# EAGLE design wbo2_1A (EAGLE 7.6.0)
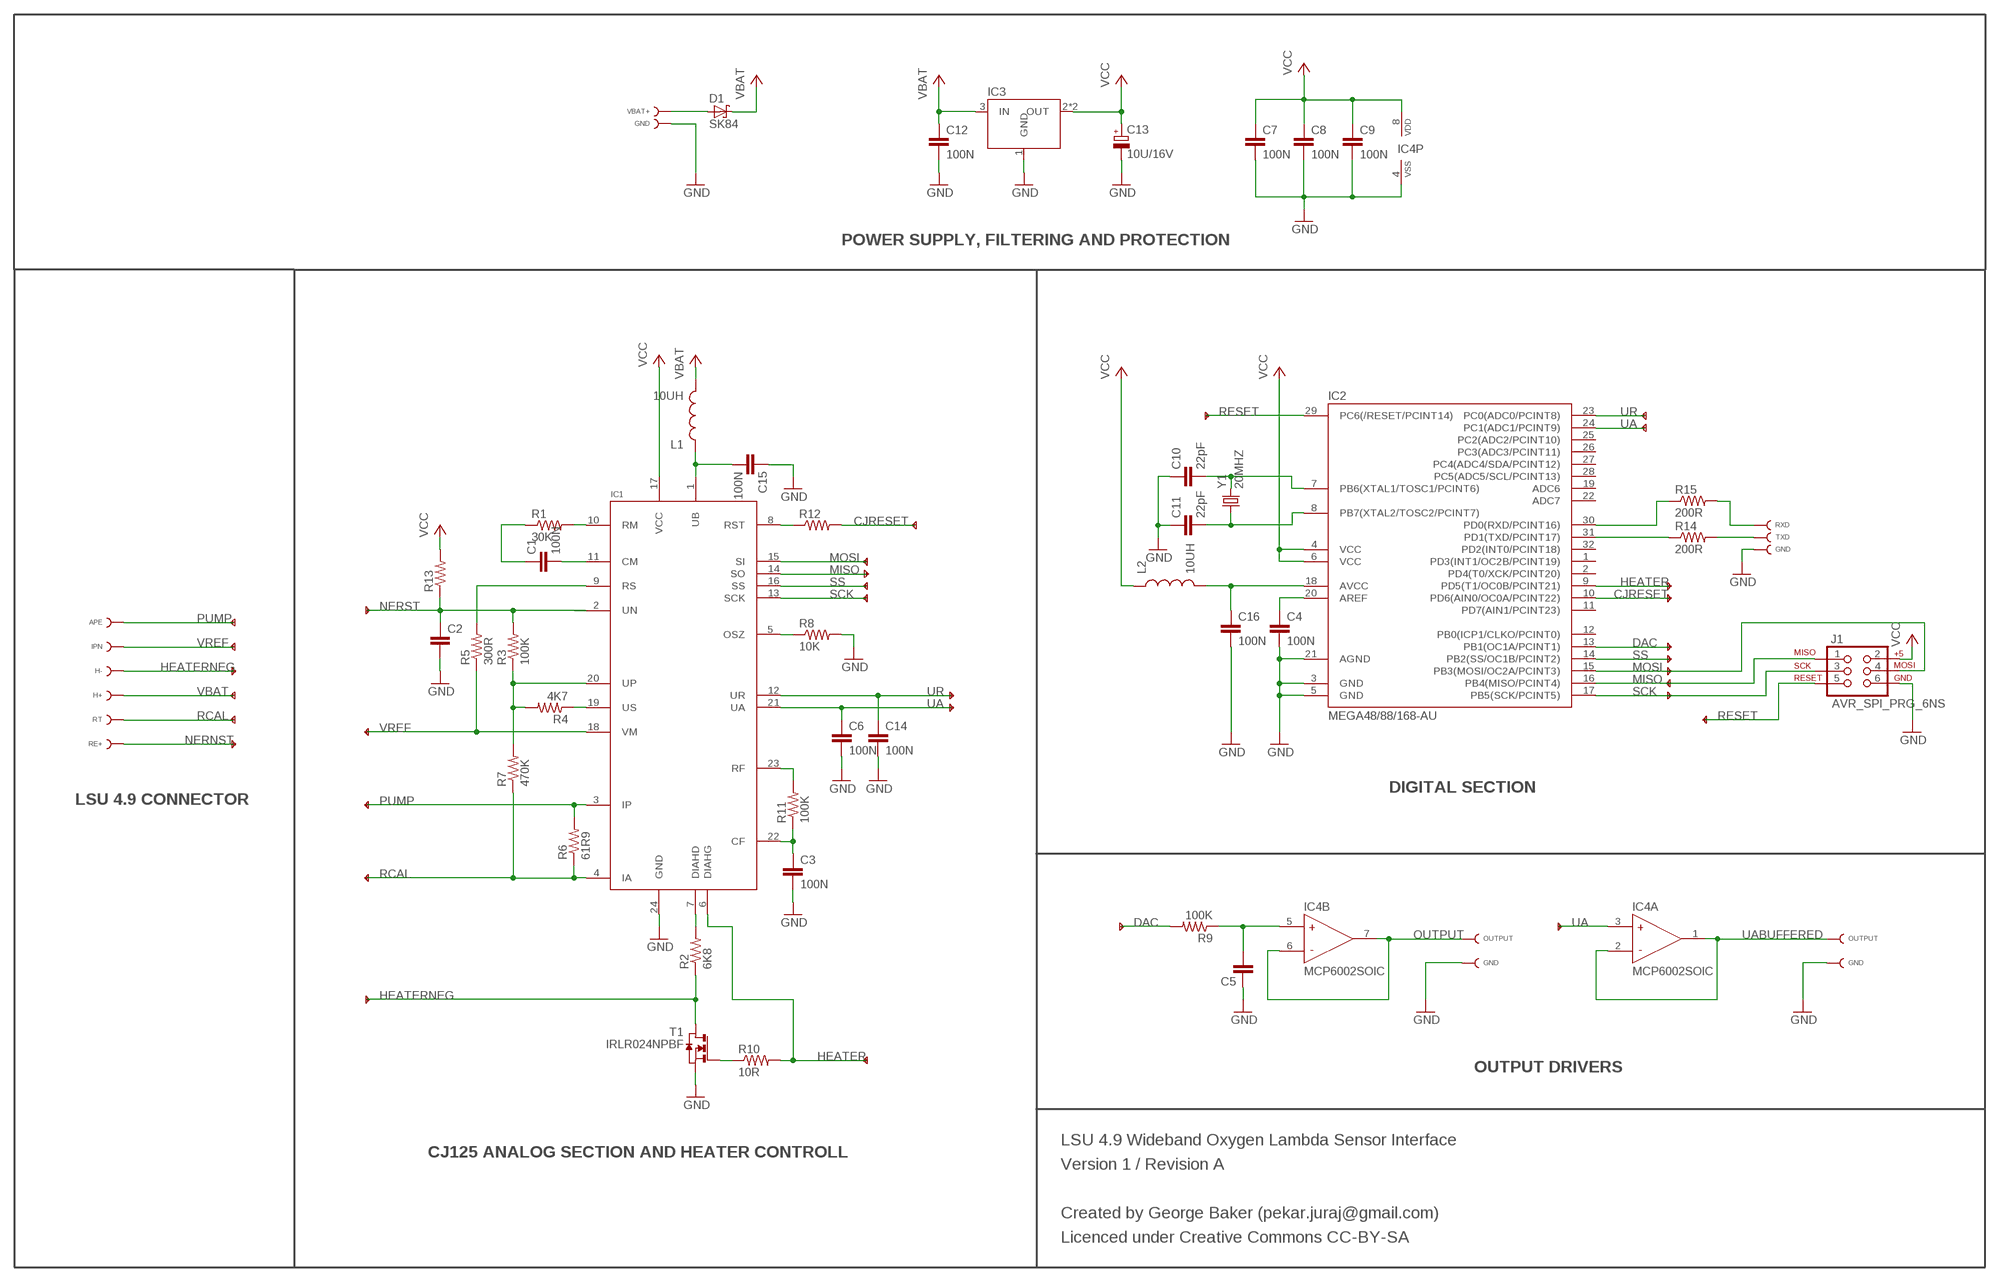
[diagram p0: schematic, sheet 1]

## Parts
C1  100N  CAP0805  [0805]
C2  CAP0805  [0805]
C3  100N  CAP0805  [0805]
C4  100N  CAP0805  [0805]
C5  CAP0805  [0805]
C6  100N  CAP0805  [0805]
C7  100N  CAP0805  [0805]
C8  100N  CAP0805  [0805]
C9  100N  CAP0805  [0805]
C10  22pF  CAP0805  [0805]
C11  22pF  CAP0805  [0805]
C12  100N  CAP0805  [0805]
C13  10U/16V  CPOL-EUSMCA  [SMC_A]
C14  100N  CAP0805  [0805]
C15  100N  CAP0805  [0805]
C16  100N  CAP0805  [0805]
D1  SK84  SCHOTTKY-DIODESMC  [SMC]
IC1  CJ125_SOIC24  [SO24W]
IC2  MEGA48/88/168-AU  [TQFP32-08]
IC3  REG1117_SOT-223  [SOT223]
IC4  MCP6002SOIC  [SO8]
J1  AVR_SPI_PRG_6NS  [2X3-NS]
L1  10UH  INDUCTOR0805  [0805]
L2  10UH  INDUCTOR0805  [0805]
PAD1  APE  CONPAD-DUAL-HOLE-1.5MM  [CONPAD-DUAL-HOLE-1.5MM]
PAD2  IPN  CONPAD-DUAL-HOLE-1.5MM  [CONPAD-DUAL-HOLE-1.5MM]
PAD3  H-  CONPAD-DUAL-HOLE-1.5MM  [CONPAD-DUAL-HOLE-1.5MM]
PAD4  H+  CONPAD-DUAL-HOLE-1.5MM  [CONPAD-DUAL-HOLE-1.5MM]
PAD5  RT  CONPAD-DUAL-HOLE-1.5MM  [CONPAD-DUAL-HOLE-1.5MM]
PAD6  RE+  CONPAD-DUAL-HOLE-1.5MM  [CONPAD-DUAL-HOLE-1.5MM]
PAD7  VBAT+  CONPAD-DUAL-HOLE-1.5MM  [CONPAD-DUAL-HOLE-1.5MM]
PAD8  GND  CONPAD-DUAL-HOLE-1.5MM  [CONPAD-DUAL-HOLE-1.5MM]
PAD9  RXD  CONPAD-DUAL-HOLE-1.5MM  [CONPAD-DUAL-HOLE-1.5MM]
PAD10  TXD  CONPAD-DUAL-HOLE-1.5MM  [CONPAD-DUAL-HOLE-1.5MM]
PAD11  GND  CONPAD-DUAL-HOLE-1.5MM  [CONPAD-DUAL-HOLE-1.5MM]
PAD12  OUTPUT  CONPAD-DUAL-HOLE-1.5MM  [CONPAD-DUAL-HOLE-1.5MM]
PAD13  GND  CONPAD-DUAL-HOLE-1.5MM  [CONPAD-DUAL-HOLE-1.5MM]
PAD14  OUTPUT  CONPAD-DUAL-HOLE-1.5MM  [CONPAD-DUAL-HOLE-1.5MM]
PAD15  GND  CONPAD-DUAL-HOLE-1.5MM  [CONPAD-DUAL-HOLE-1.5MM]
R1  30K  RESISTOR0805-RES  [0805]
R2  6K8  RESISTOR0805-RES  [0805]
R3  100K  RESISTOR0805-RES  [0805]
R4  4K7  RESISTOR0805-RES  [0805]
R5  300R  RESISTOR0805-RES  [0805]
R6  61R9  RESISTOR0805-RES  [0805]
R7  470K  RESISTOR0805-RES  [0805]
R8  10K  RESISTOR0805-RES  [0805]
R9  100K  RESISTOR0805-RES  [0805]
R10  10R  RESISTOR0805-RES  [0805]
R11  100K  RESISTOR0805-RES  [0805]
R12  RESISTOR0805-RES  [0805]
R13  RESISTOR0805-RES  [0805]
R14  200R  RESISTOR0805-RES  [0805]
R15  200R  RESISTOR0805-RES  [0805]
T1  IRLR024NPBF  NMOSFET_TO252  [TO252]
Y1  20MHZ  CRYSTAL_ILCX13  [CRYSTAL_ILCX13]

## Nets
CJRESET: IC2.10(PD6(AIN0/OC0A/PCINT22)) R12.2
DAC: IC2.13(PB1(OC1A/PCINT1)) R9.2
GND: C2.2 C3.2 C4.2 C5.1 C6.2 C7.2 C8.2 C9.2 C10.1 C11.1 C12.2 C13.- C14.2 C15.1 C16.2 IC1.24(GND) IC2.3(GND) IC2.5(GND) IC2.21(AGND) IC3.1(GND) IC4.4(P:VSS) J1.6 PAD8.P$1@1 PAD8.P$1@2 PAD11.P$1@1 PAD11.P$1@2 PAD13.P$1@1 PAD13.P$1@2 PAD15.P$1@1 PAD15.P$1@2 R8.2 T1.2(S)
HEATER: IC1.6(DIAHG) IC2.9(PD5(T1/OC0B/PCINT21)) R10.2
HEATERNEG: PAD3.P$1@1 PAD3.P$1@2 R2.1 T1.3(D)
MISO: IC1.14(SO) IC2.16(PB4(MISO/PCINT4)) J1.1
MOSI: IC1.15(SI) IC2.15(PB3(MOSI/OC2A/PCINT3)) J1.4
N$1: IC1.7(DIAHD) R2.2
N$2: IC1.23(RF) R11.2
N$3: C3.1 IC1.22(CF) R11.1
N$4: C16.1 IC2.18(AVCC) L2.2
N$5: C15.2 IC1.1(UB) L1.1
N$6: IC1.19(US) R4.1
N$7: C4.1 IC2.20(AREF)
N$8: IC1.20(UP) R3.1 R4.2 R7.2
N$9: C10.2 IC2.7(PB6(XTAL1/TOSC1/PCINT6)) Y1.3
N$10: C5.2 IC4.5(B:NONINV) R9.1
N$11: C11.2 IC2.8(PB7(XTAL2/TOSC2/PCINT7)) Y1.1
N$12: D1.A PAD7.P$1@1 PAD7.P$1@2
N$13: IC1.10(RM) R1.2
N$14: R10.1 T1.1(G)
N$15: PAD10.P$1@1 PAD10.P$1@2 R14.2
N$16: IC1.9(RS) R5.2
N$17: PAD9.P$1@1 PAD9.P$1@2 R15.2
N$18: C1.1 R1.1
N$19: C1.2 IC1.11(CM)
N$22: IC1.5(OSZ) R8.1
N$24: IC1.8(RST) R12.1
NERNST: PAD6.P$1@1 PAD6.P$1@2
NERST: C2.1 IC1.2(UN) R3.2 R13.1
OUTPUT: IC4.6(B:INV) IC4.7(B:OUT) PAD12.P$1@1 PAD12.P$1@2
PUMP: IC1.3(IP) PAD1.P$1@1 PAD1.P$1@2 R6.2
RCAL: IC1.4(IA) PAD5.P$1@1 PAD5.P$1@2 R6.1 R7.1
RESET: IC2.29(PC6(/RESET/PCINT14)) J1.5
RXD: IC2.30(PD0(RXD/PCINT16)) R15.1
SCK: IC1.13(SCK) IC2.17(PB5(SCK/PCINT5)) J1.3
SS: IC1.16(SS) IC2.14(PB2(SS/OC1B/PCINT2))
TXD: IC2.31(PD1(TXD/PCINT17)) R14.1
UA: C6.1 IC1.21(UA) IC2.24(PC1(ADC1/PCINT9)) IC4.3(A:NONINV)
UABUFFERED: IC4.1(A:OUT) IC4.2(A:INV) PAD14.P$1@1 PAD14.P$1@2
UR: C14.1 IC1.12(UR) IC2.23(PC0(ADC0/PCINT8))
VBAT: C12.1 D1.C IC3.3(IN) L1.2 PAD4.P$1@1 PAD4.P$1@2
VCC: C7.1 C8.1 C9.1 C13.+ IC1.17(VCC) IC2.4(VCC) IC2.6(VCC) IC3.2(OUT) IC3.4(OUT) IC4.8(P:VDD) J1.2 L2.1 R13.2
VREF: IC1.18(VM) PAD2.P$1@1 PAD2.P$1@2 R5.1
Unconnected: IC2.1(PD3(INT1/OC2B/PCINT19)) IC2.2(PD4(T0/XCK/PCINT20)) IC2.11(PD7(AIN1/PCINT23)) IC2.12(PB0(ICP1/CLKO/PCINT0)) IC2.19(ADC6) IC2.22(ADC7) IC2.25(PC2(ADC2/PCINT10)) IC2.26(PC3(ADC3/PCINT11)) IC2.27(PC4(ADC4/SDA/PCINT12)) IC2.28(PC5(ADC5/SCL/PCINT13)) IC2.32(PD2(INT0/PCINT18))

## Notes on the sheet
- POWER SUPPLY, FILTERING AND PROTECTION
- DIGITAL SECTION
- LSU 4.9 CONNECTOR
- OUTPUT DRIVERS
- LSU 4.9 Wideband Oxygen Lambda Sensor Interface
- CJ125 ANALOG SECTION AND HEATER CONTROLL
- Version 1 / Revision A
- Created by George Baker (pekar.juraj@gmail.com)
- Licenced under Creative Commons CC-BY-SA

## Library data of the parts
C1-C12 C14-C16 = SparkFun-Capacitors:CAP: Capacitor Standard 0603 ceramic capacitor, and 0.1" leaded capacitor.
C13 = rcl:CPOL-EU: POLARIZED CAPACITOR, European symbol
D1 = diode:SCHOTTKY-DIODE: Schottky Diode
IC1 = GGLibrary:CJ125
IC2 = avr-6:MEGA48/88/168
IC3 = GGLibrary:REG1117
IC4 = GGLibrary:MCP6002
J1 = SparkFun-Connectors:AVR_SPI_PRG_6: AVR ISP 6 Pin This is the reduced ISP connector for AVR programming. Common on Arduino. This footprint will take up less PCB space and can be used with a 10-pin to 6-pin adapter such as SKU: BOB-08508
L1 L2 = SparkFun-Passives:INDUCTOR: Inductors Basic Inductor/Choke - 0603 and 1206. Footprints are not proven and vary greatly between part numbers. SRN6045- 33uH, 20% 1.4A
PAD1-PAD15 = GGLibrary:CONPAD
R1-R15 = SparkFun-Resistors:RESISTOR: Resistor Basic schematic elements and footprints for 0603, 1206, and PTH resistors.
T1 = GGLibrary:NMOSFET
Y1 = GGLibrary:CRYSTAL: Various standard crystals. Proven footprints. Spark Fun Electronics SKU : COM-00534

## Board
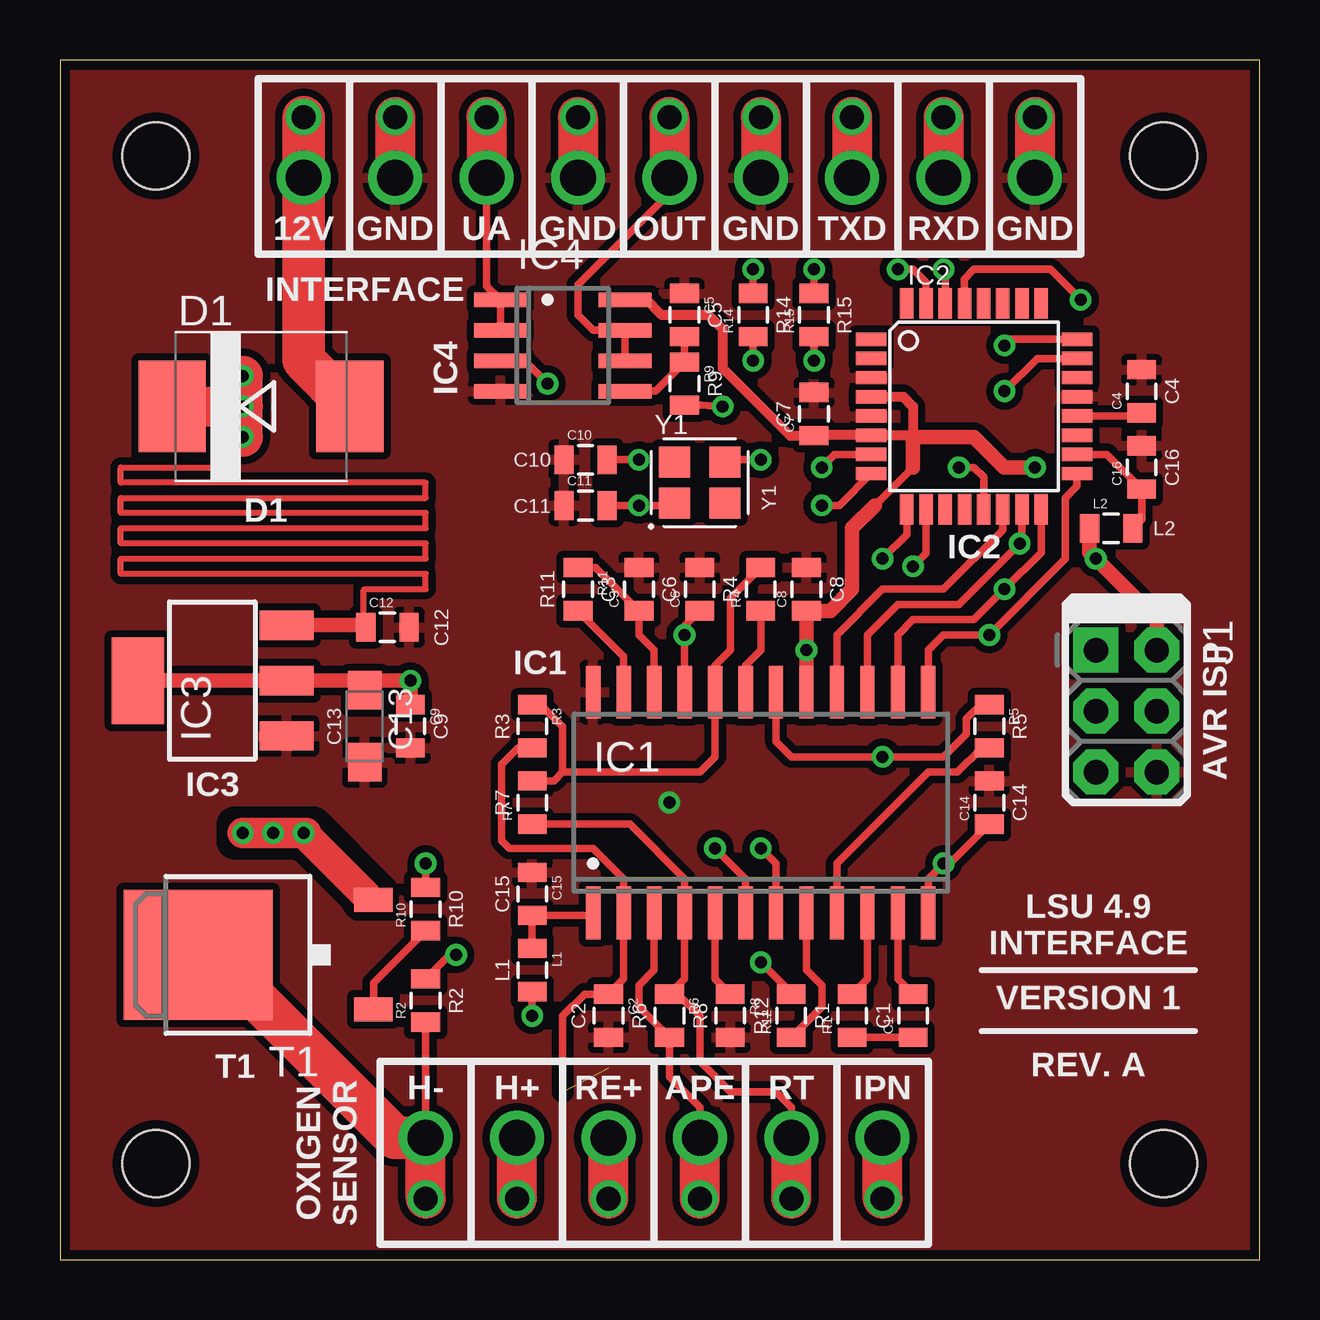
[diagram p1: board, top side]
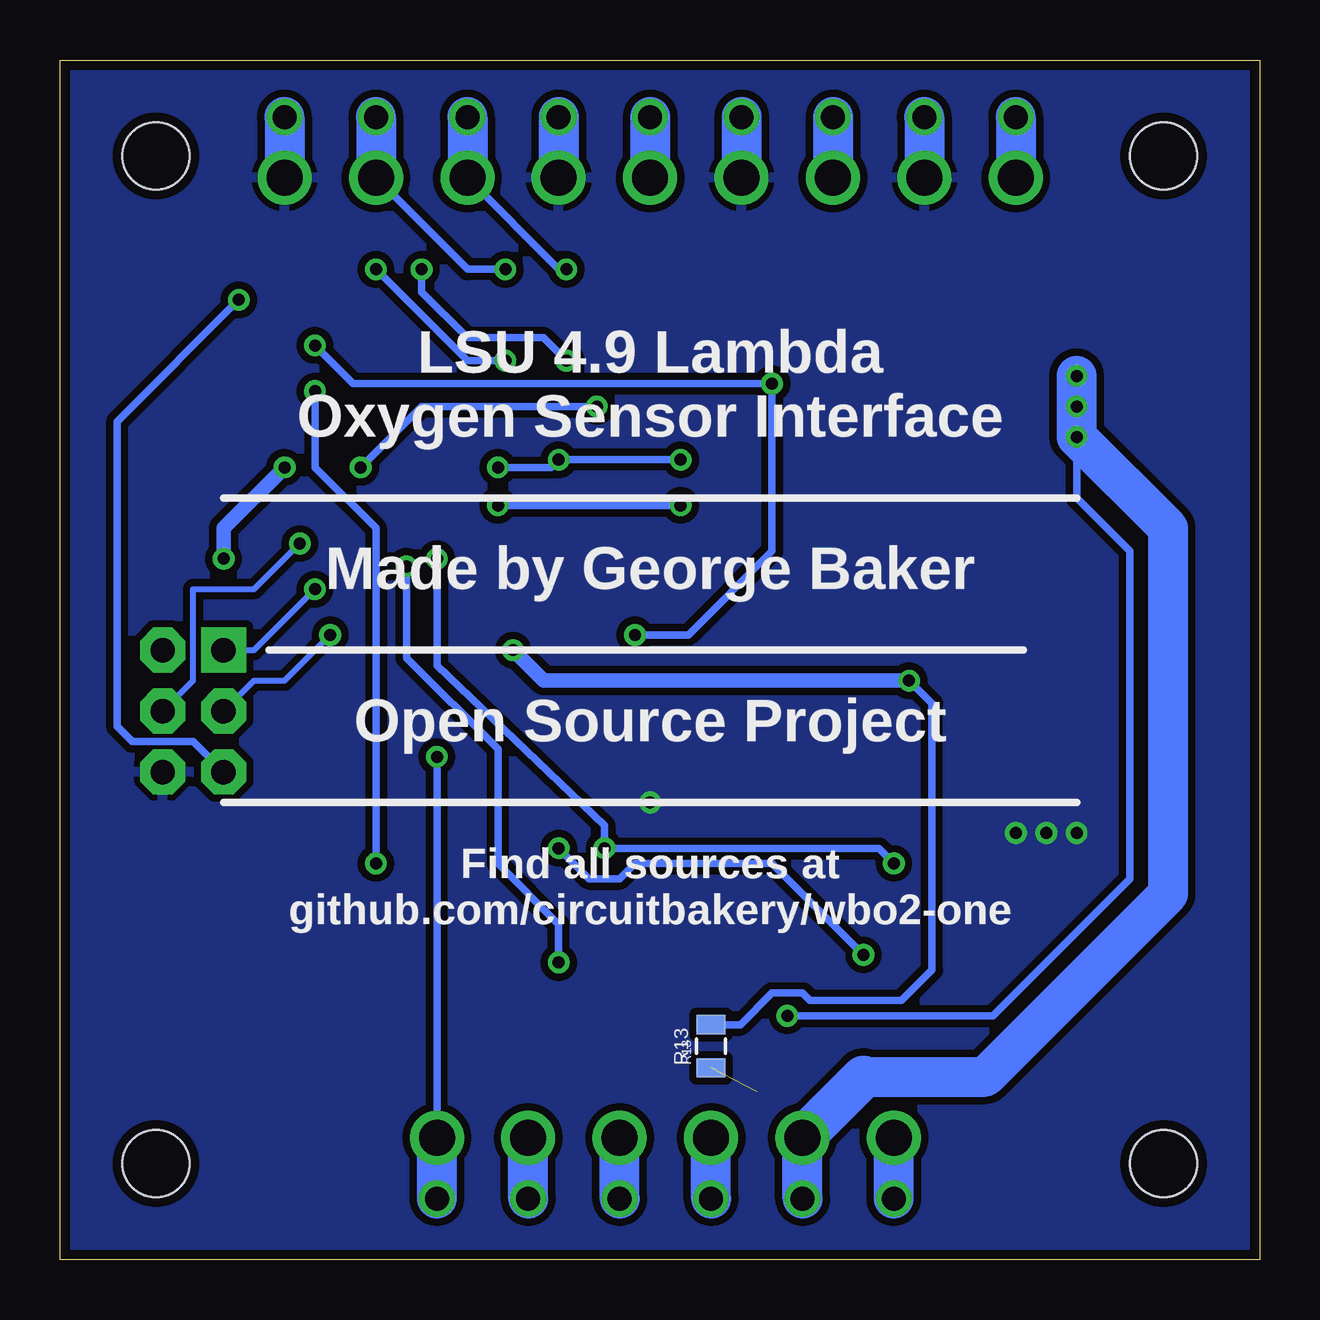
[diagram p2: board, bottom side, seen from below]

Size 50 x 50 mm. Coordinates in mm from the lower left corner, seen from the top.
Outline: 0,0 50,0 50,50 0,50 0,0
Copper layers (1*16): Top 0.035mm / dielectric 1.5mm / Bottom 0.035mm
Design rules "default *": minimum track width 6mil, minimum drill 12mil, track to track 6mil, track to pad 6mil, pad to pad 6mil, via to via 6mil, smd to smd 6mil, copper to edge 16mil, drill to drill 8mil, minimum pad ring 10mil, minimum via ring 8mil, stop-mask expansion 3mil, vias tented up to drill 20mil, thermal gap 10mil
Holes 2.8 mm at 4,46 46,46 4,4 46,4

### Footprints (pad centres in the part's own frame; a part is rotated, then mirrored left to right if it is on the bottom)
0805 = smd 0.8 x 1.2: 1 -0.9,0; 2 0.9,0
SMC_A = smd 1.6 x 1.4: + -1.5,0; - 1.5,0
SMC = smd 2.8 x 3.8: A 3.7,0; C -3.7,0
SO24W = smd 0.6 x 2.2: 1 -6.985,-4.6; 2 -5.715,-4.6; 3 -4.445,-4.6; 4 -3.175,-4.6; 5 -1.905,-4.6; 6 -0.635,-4.6; 7 0.635,-4.6; 8 1.905,-4.6; 9 3.175,-4.6; 10 4.445,-4.6; 11 5.715,-4.6; 12 6.985,-4.6; 13 6.985,4.6; 14 5.715,4.6; 15 4.445,4.6; 16 3.175,4.6; 17 1.905,4.6; 18 0.635,4.6; 19 -0.635,4.6; 20 -1.905,4.6; 21 -3.175,4.6; 22 -4.445,4.6; 23 -5.715,4.6; 24 -6.985,4.6
TQFP32-08 = smd 1.27 x 0.559: 1 -4.293,2.8; 2 -4.293,2; 3 -4.293,1.2; 4 -4.293,0.4; 5 -4.293,-0.4; 6 -4.293,-1.2; 7 -4.293,-2; 8 -4.293,-2.8; 17 4.293,-2.8; 18 4.293,-2; 19 4.293,-1.2; 20 4.293,-0.4; 21 4.293,0.4; 22 4.293,1.2; 23 4.293,2; 24 4.293,2.8 | smd 0.559 x 1.27: 9 -2.8,-4.293; 10 -2,-4.293; 11 -1.2,-4.293; 12 -0.4,-4.293; 13 0.4,-4.293; 14 1.2,-4.293; 15 2,-4.293; 16 2.8,-4.293; 25 2.8,4.293; 26 2,4.293; 27 1.2,4.293; 28 0.4,4.293; 29 -0.4,4.293; 30 -1.2,4.293; 31 -2,4.293; 32 -2.8,4.293
SOT223 = smd 1.219 x 2.235: 1 -2.311,-3.099; 2 0,-3.099; 3 2.311,-3.099 | smd 3.6 x 2.2: 4 0,3.099
SO8 = smd 0.6 x 2.2: 1 -1.905,-2.6; 2 -0.635,-2.6; 3 0.635,-2.6; 4 1.905,-2.6; 5 1.905,2.6; 6 0.635,2.6; 7 -0.635,2.6; 8 -1.905,2.6
2X3-NS = drill 1.016 pad 1.88 square: 1 -2.54,-1.27 | drill 1.016 pad 1.88 octagon: 2 -2.54,1.27; 3 0,-1.27; 4 0,1.27; 5 2.54,-1.27; 6 2.54,1.27
CONPAD-DUAL-HOLE-1.5MM = drill 1: P$1@1 0,0 | drill 1.5: P$1@2 0,-2.54
TO252 = smd 1 x 1.6: 1 -2.28,-4.8; 2 2.28,-4.8 | smd 5.4 x 6.2: 3 0,2.5
CRYSTAL_ILCX13 = smd 1.3 x 1.3: 1 -1.05,-0.85; 2 1.05,-0.85; 3 1.05,0.85; 4 -1.05,0.85

### Placement (x,y rotation side)
C1  35.56,10.16 90 top
C2  22.86,10.16 270 top
C3  24.13,27.94 90 top
C4  45.09,36.2 90 top
C5  26.04,39.37 270 top
C6  26.67,27.94 90 top
C7  31.43,35.24 90 top
C8  31.11,27.94 90 top
C9  14.61,22.23 270 top
C10  21.91,33.34 0 top
C11  21.91,31.43 0 top
C12  13.65,26.35 0 top
C13  12.7,22.23 270 top
C14  38.73,19.05 90 top
C15  19.68,15.24 270 top
C16  45.09,33.02 90 top
D1  8.38,35.56 0 top
IC1  29.21,19.05 0 top
IC2  38.1,35.56 0 top
IC3  6.35,24.13 90 top
IC4  20.95,38.1 270 top
J1  44.45,22.86 270 top
L1  19.68,12.06 270 top
L2  43.81,30.48 0 top
PAD1  26.67,2.54 180 top
PAD2  34.29,2.54 180 top
PAD3  15.24,2.54 180 top
PAD4  19.05,2.54 180 top
PAD5  30.48,2.54 180 top
PAD6  22.86,2.54 180 top
PAD7  10.16,47.62 0 top
PAD8  13.97,47.62 0 top
PAD9  36.83,47.62 0 top
PAD10  33.02,47.62 0 top
PAD11  40.64,47.62 0 top
PAD12  25.4,47.62 0 top
PAD13  29.21,47.62 0 top
PAD14  17.78,47.62 0 top
PAD15  21.59,47.62 0 top
R1  33.02,10.16 90 top
R2  15.24,10.79 90 top
R3  19.68,22.23 270 top
R4  29.21,27.94 90 top
R5  38.73,22.23 270 top
R6  25.4,10.16 270 top
R7  19.68,19.05 90 top
R8  27.94,10.16 270 top
R9  26.04,36.51 270 top
R10  15.24,14.61 90 top
R11  21.59,27.94 270 top
R12  30.48,10.16 90 top
R13  22.86,8.89 90 bottom
R14  28.89,39.37 90 top
R15  31.43,39.37 90 top
T1  8.26,12.7 90 top
Y1  26.67,32.38 0 top

### Tracks (layer width: path | path; a pad name or v marks a point on that pad's centre or on a via)
CJRESET  (via drill 0.5)
  Top 0.305: 30.48,11.11 v29.21,12.38 | v35.56,28.89 36.1,29.43 IC2.10
  Top 0.406: R12.2 30.48,11.11
  Bottom 0.305: v29.21,12.38 29.21,13.97 31.75,16.51 31.75,21.27 35.56,25.08 v35.56,28.89
DAC  (via drill 0.5)
  Top 0.305: IC2.13 38.5,32.62 38.1,33.02 v37.47,33.02 | R9.2 26.72,35.61 v27.62,35.56
  Bottom 0.305: v37.47,33.02 34.92,35.56 v27.62,35.56
GND  (via drill 0.5)
  Top 1.016: T1.2 arc-45 12.89,15.05 12.7,15.24
  Top 1.27: v7.62,17.78 v10.16,17.78 | v10.16,17.78 10.26,17.78 | 12.7,15.24 v10.16,17.78
  other vias: 25.4,19.05 8.89,17.78
  pour Top (isolate 0.305): -2.54,-3.81 52.07,-3.81 52.07,50.8 -2.54,50.8
  pour Bottom (isolate 0.305): -1.27,-2.54 53.34,-2.54 53.34,52.07 -1.27,52.07
  cutout Top (rank 2): 13.97,14.29 13.97,15.29 arc45 13.78,15.74 10.98,18.55 arc45 10.53,18.73 7.3,18.73 arc90 6.67,18.1 6.67,17.46 arc90 7.3,16.83 9.58,16.83 arc-45 10.03,16.64 11.88,14.79 arc45 12.33,14.29
HEATER  (via drill 0.5)
  Top 0.305: IC1.6 28.57,15.88 v27.3,17.14 | v15.24,16.51 R10.2 | IC2.9 35.3,30.22 v34.29,29.21
  Bottom 0.305: v15.24,16.51 15.88,17.14 v27.3,17.14 27.3,18.1 34.29,24.77 v34.29,29.21
HEATERNEG
  Top 0.305: R2.1 PAD3.P$1@2 PAD3.P$1@1
  Top 1.778: T1.3 6.35,12.7 13.97,5.08 PAD3.P$1@2
MISO  (via drill 0.5)
  Top 0.305: IC1.14 34.92,26.04 35.56,26.67 38.1,26.67 v39.37,27.94 40.9,29.47 IC2.16
  Bottom 0.254: J1.1 41.91,25.4 v39.37,27.94
MOSI  (via drill 0.5)
  Top 0.305: IC2.15 40.1,29.94 v40.01,29.84 37.47,27.3 34.92,27.3 33.66,26.04 IC1.15
  Bottom 0.254: J1.4 44.45,24.13 44.45,27.94 41.91,27.94 v40.01,29.84
N$1  (via drill 0.5)
  Top 0.305: IC1.7 29.84,16.51 v29.21,17.14 | v16.51,12.7 16.25,12.7 R2.2
  Bottom 0.305: v29.21,17.14 27.94,15.88 26.67,15.88 26.04,16.51 20.32,16.51 v16.51,12.7
N$2
  Top 0.305: IC1.23 23.5,25.14 R11.2
N$3
  Top 0.305: IC1.22 24.77,25.4 24.13,26.04 C3.1 22.33,28.84 R11.1
N$4
  Top 0.305: L2.2 45.09,30.85 C16.1 43.65,33.56 IC2.18
N$5
  Top 0.305: IC1.1 22.11,14.34 C15.2 L1.1
N$6
  Top 0.305: IC1.19 28.57,24.77 29.21,25.4 R4.1
N$7
  Top 0.305: IC2.20 44.95,35.16 C4.1
N$8
  Top 0.305: R4.2 27.94,27.57 27.94,25.4 27.3,24.77 IC1.20 27.3,20.95 26.67,20.32 20.95,20.32 | R3.1 20.05,23.12 20.95,22.23 20.95,20.32 | R7.2 20.59,19.95 20.95,20.32
N$9  (via drill 0.5)
  Top 0.305: IC2.7 32.29,33.56 v31.75,33.02 | v29.21,33.34 27.82,33.34 Y1.3 | C10.2 v24.13,33.34
  Bottom 0.305: v31.75,33.02 29.53,33.02 v29.21,33.34 v24.13,33.34
N$10
  Top 0.305: IC4.5 24.82,36.2 R9.1 C5.2
N$11  (via drill 0.5)
  Top 0.305: Y1.1 25.52,31.43 v24.13,31.43 C11.2 | v31.75,31.43 32.48,31.43 IC2.8
  Bottom 0.305: v31.75,31.43 v24.13,31.43
N$12
  Top 1.778: PAD7.P$1@1 10.16,37.48 D1.A
N$13
  Top 0.305: IC1.10 33.66,11.7 R1.2
N$14
  Top 0.305: T1.1 13.07,10.44 13.07,11.54 R10.1
N$15  (via drill 0.5)
  Top 0.305: R14.2 v28.89,41.27
  Bottom 0.305: v28.89,41.27 29.21,41.27 PAD10.P$1@2
N$16
  Top 0.305: IC1.9 32.38,16.51 36.2,20.32 37.41,20.32 38.42,21.32 R5.2
N$17  (via drill 0.5)
  Top 0.305: R15.2 v31.43,41.27
  Bottom 0.305: v31.43,41.27 33.02,41.27 PAD9.P$1@2
N$18
  Top 0.305: R1.1 C1.1
N$19
  Top 0.305: IC1.11 34.92,11.7 C1.2
N$22
  Top 0.305: IC1.5 27.3,11.7 R8.1
N$24
  Top 0.305: IC1.8 31.11,12.06 31.75,11.43 31.75,10.53 R12.1
NERST  (1 unrouted)
  Top 0.305: R3.2 19.1,21.32 18.41,20.64 18.41,17.46 18.73,17.14 22.23,17.14 23.5,15.88 IC1.2 23.5,11.7 C2.1 21.86,11.06 20.95,10.16 20.95,6.99
OUTPUT
  Top 0.305: IC4.6 IC4.7 22.23,38.73 21.59,39.37 21.59,40.64 25.4,44.45 PAD12.P$1@1
PUMP
  Top 0.305: IC1.3 24.77,12.06 24.13,11.43 24.13,10.53 R6.2 25.4,7.62 26.67,6.35 PAD1.P$1@1
RCAL
  Top 0.305: R7.1 23.76,18.15 26.04,15.88 IC1.4 26.04,11.7 R6.1 25.77,11.06 26.67,10.16 26.67,8.26 27.94,6.99 29.84,6.99 30.48,6.35 PAD5.P$1@1
RESET  (via drill 0.5)
  Top 0.305: v42.55,40.01 41.27,41.27 38.1,41.27 37.7,40.88 IC2.29
  Bottom 0.305: J1.5 44.45,21.59 46.99,21.59 47.62,22.23 47.62,34.92 v42.55,40.01
RXD  (via drill 0.5)
  Top 0.305: IC2.30 36.9,41.2 v36.83,41.27 | v31.43,37.47 R15.1
  Bottom 0.305: v36.83,41.27 33.02,37.47 v31.43,37.47
SCK  (via drill 0.5)
  Top 0.305: IC2.17 42.39,32.23 41.91,31.75 41.91,29.21 v38.73,26.04 36.83,26.04 36.2,25.4 IC1.13
  Bottom 0.254: J1.3 41.91,24.13 40.64,24.13 v38.73,26.04
SS
  Top 0.305: IC1.16 32.38,26.04 34.29,27.94 36.83,27.94 39.3,30.41 IC2.14
TXD  (via drill 0.5)
  Top 0.305: IC2.31 36.1,40.73 35.56,41.27 v34.92,41.27 | v28.89,37.47 R14.1
  Bottom 0.305: v34.92,41.27 34.92,40.32 33.02,38.42 29.84,38.42 v28.89,37.47
UA  (via drill 0.5)
  Top 0.305: IC1.21 v26.04,26.04 26.04,26.41 C6.1 | IC4.3 19.37,37.47 v20.32,36.51 | IC2.24 39.63,38.36 v39.37,38.1
  Bottom 0.305: v26.04,26.04 23.81,26.04 20.32,29.53 v20.32,36.51 37.78,36.51 v39.37,38.1
UABUFFERED
  Top 0.305: IC4.2 IC4.1 17.78,40.58 PAD14.P$1@2
UR  (via drill 0.5)
  Top 0.305: IC2.23 40.73,37.56 v39.37,36.2 | IC1.12 36.2,15.88 v36.83,16.51 37.09,16.51 C14.1
  Bottom 0.305: v39.37,36.2 39.37,33.02 36.83,30.48 v36.83,16.51
VBAT  (via drill 0.5)
  Top 0.254: C12.1 12.66,26.44 12.66,27.9 12.7,27.94 15.24,27.94 15.24,28.57 2.54,28.57 2.54,29.21 15.24,29.21 15.24,29.84 2.54,29.84 2.54,30.48 15.24,30.48 15.24,31.11 2.54,31.11 2.54,31.75 15.24,31.75 15.24,32.38 2.54,32.38 2.54,33.02 6.35,33.02 v7.62,34.29
  Top 0.305: L1.2 v19.68,10.16
  Top 0.61: 12.66,26.44 IC3.3
  Top 1.676: v7.62,34.29 v7.62,35.56 | v7.62,35.56 v7.62,36.83 | D1.C v7.62,35.56
  Bottom 0.305: v19.68,10.16 11.11,10.16 5.4,15.88 5.4,29.53 7.62,31.75 v7.62,35.56
  Bottom 1.676: 16.51,7.62 11.43,7.62 3.81,15.24 3.81,30.48 v7.62,34.29 v7.62,35.56 v7.62,36.83
  Bottom 1.778: 16.51,7.62 PAD4.P$1@2
VCC  (via drill 0.5)
  Top 0.305: 33.97,31.43 35.56,33.02
  Top 0.406: 35.49,34.36 IC2.6 31.45,34.36 C7.1 30.43,34.34 27.62,37.15 27.62,38.79 27.04,39.37 25.08,39.37 24.45,40.01 IC4.8 | 35.49,34.36 35.56,34.29 | IC2.4 35.16,35.96 35.56,35.56 35.56,34.43 35.49,34.36
  Top 0.61: IC1.17 v31.11,25.4 C8.1 32.12,27.04 33.02,27.94 33.02,30.48 33.97,31.43 | 35.56,33.02 35.56,34.29 38.1,34.29 39.37,33.02 v40.64,33.02 | L2.1 42.91,29.48 v43.18,29.21 45.72,26.67 J1.2 | IC3.4 IC3.2 12.29,24.13 C13.+ 13.11,24.13 v14.61,24.13 C9.1
  Bottom 0.305: R13.2 21.64,9.79 20.32,11.11 19.05,11.11 18.73,10.79 14.92,10.79 13.65,12.06 13.65,23.18 v14.61,24.13
  Bottom 0.61: v14.61,24.13 29.84,24.13 v31.11,25.4 | v43.18,29.21 43.18,30.48 v40.64,33.02
VREF  (via drill 0.5)
  Top 0.305: R5.1 38.37,23.12 37.78,22.54 37.78,21.91 36.83,20.95 v34.29,20.95 30.48,20.95 29.84,21.59 IC1.18
  Bottom 0.305: PAD2.P$1@1 v34.29,20.95

### Text on the board
tPlace: 12V | GND | UA | GND | OUT | GND | TXD | RXD | GND | INTERFACE | LSU 4.9 / INTERFACE | VERSION 1 | REV. A | H- | H+ | RE+ | APE | RT | IPN | OXIGEN / SENSOR
bPlace: LSU 4.9 Lambda / Oxygen Sensor Interface | Made by George Baker | Open Source Project | Find all sources at / github.com/circuitbakery/wbo2-one
_tNames: C5 | R14 | R15 | IC4 | R9 | C4 | C7 | C10 | C16 | D1 | Y1 | C11 | L2 | IC2 | R11 | C3 | C6 | R4 | C8 | C12 | IC1 | AVR ISP | C13 | C9 | R3 | R5 | IC3 | R7 | C14 | R10 | C15 | L1 | R2 | C2 | R6 | R8 | R12 | R1 | C1 | T1
_bNames: R13